# Altium project Converter.PrjPCB
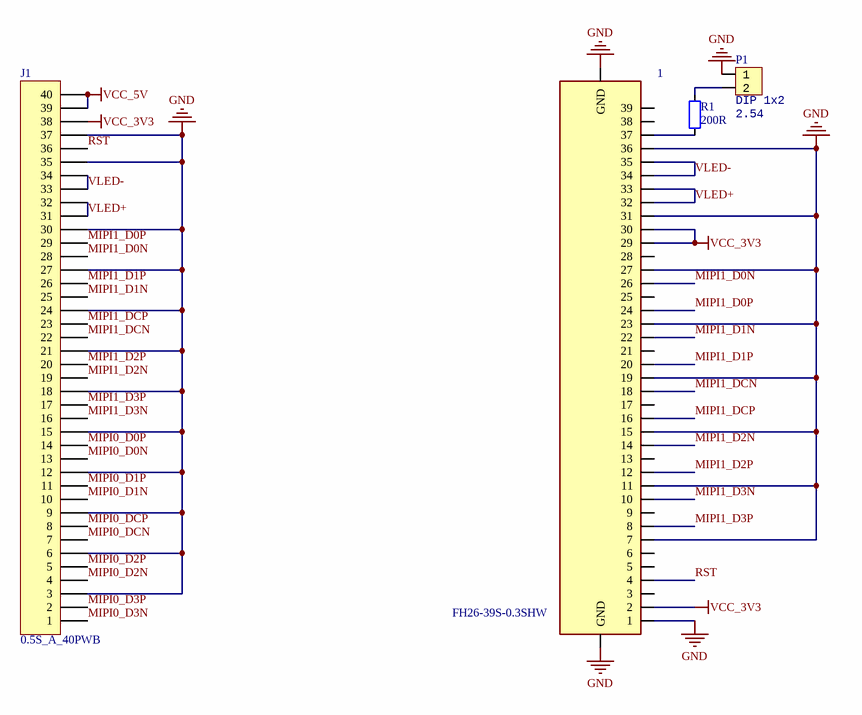
[diagram p0: Main.SchDoc]
1 sheet, 4 parts. Net scope: global (net labels, ports and power ports of the same name join across sheets).
Board file: Converter.PcbDoc

## Sheet Main.SchDoc
size A4

### Parts
1  FH26-39S-0.3SHW  [FH26-39S-0.3SHW]
J1  0.5S_A_40PWB  [FFC_0.5_40]
P1  value 2.54  [HDR1X2_2.54_180]  (hidden comment: DIP 1x2)
R1  200R  [RES_0402]

### Nets
GND: 1.1 1.7 1.11 1.15 1.19 1.23 1.27 1.31 1.36 1.GND1(GND) 1.GND2(GND) J1.3 J1.6 J1.9 J1.12 J1.15 J1.18 J1.21 J1.24 J1.27 J1.30 J1.35 J1.37 P1.1
VCC_3V3: 1.2 1.29 1.30 J1.38
VCC_5V: J1.39 J1.40
MIPI0_D0N: J1.13
MIPI0_D0P: J1.14
MIPI0_D1N: J1.10
MIPI0_D1P: J1.11
MIPI0_D2N: J1.4
MIPI0_D2P: J1.5
MIPI0_D3N: J1.1
MIPI0_D3P: J1.2
MIPI0_DCN: J1.7
MIPI0_DCP: J1.8
MIPI1_D0N: 1.26 J1.28
MIPI1_D0P: 1.24 J1.29
MIPI1_D1N: 1.22 J1.25
MIPI1_D1P: 1.20 J1.26
MIPI1_D2N: 1.14 J1.19
MIPI1_D2P: 1.12 J1.20
MIPI1_D3N: 1.10 J1.16
MIPI1_D3P: 1.8 J1.17
MIPI1_DCN: 1.18 J1.22
MIPI1_DCP: 1.16 J1.23
RST: 1.4 J1.36
VLED+: 1.32 1.33 J1.31 J1.32
VLED-: 1.34 1.35 J1.33 J1.34
Net1_37: 1.37 R1.1
NetP1_2: P1.2 R1.2

Not connected (* = marked no-connect by the designer): 1 3 5 6 9 13 17 21 25 28 38 39

### Library data of the parts
1 = FH26-39S-0.3SHW: 39 Position FPC Connector Contacts, Bottom 0.012 _0.30mm_ Surface Mount, Right Angle; MF: Hirose; Package: None; Value: *; Availability: Unavailable; MP: FH26-39S-0.3SHW; SnapEDA_Link: https://www.snapeda.com/parts/FH26-39S-0.3SHW/Hirose/view-part/44187/?ref=snap; Price: None
J1 = FPC40-0.5mm: Header, 40-Pin; LatestRevisionDate: 17-Jul-2002; LatestRevisionNote: Re-released for DXP Platform.; Publisher: Altium Limited
P1 = HDR1x2_2.54: Header; Type: DIP 1x2
R1 = 电阻-0402: Resistor; Value: 22R